# EasyEDA Pro project 便携式气体检测仪_2025-04-28.epro, board PCB1
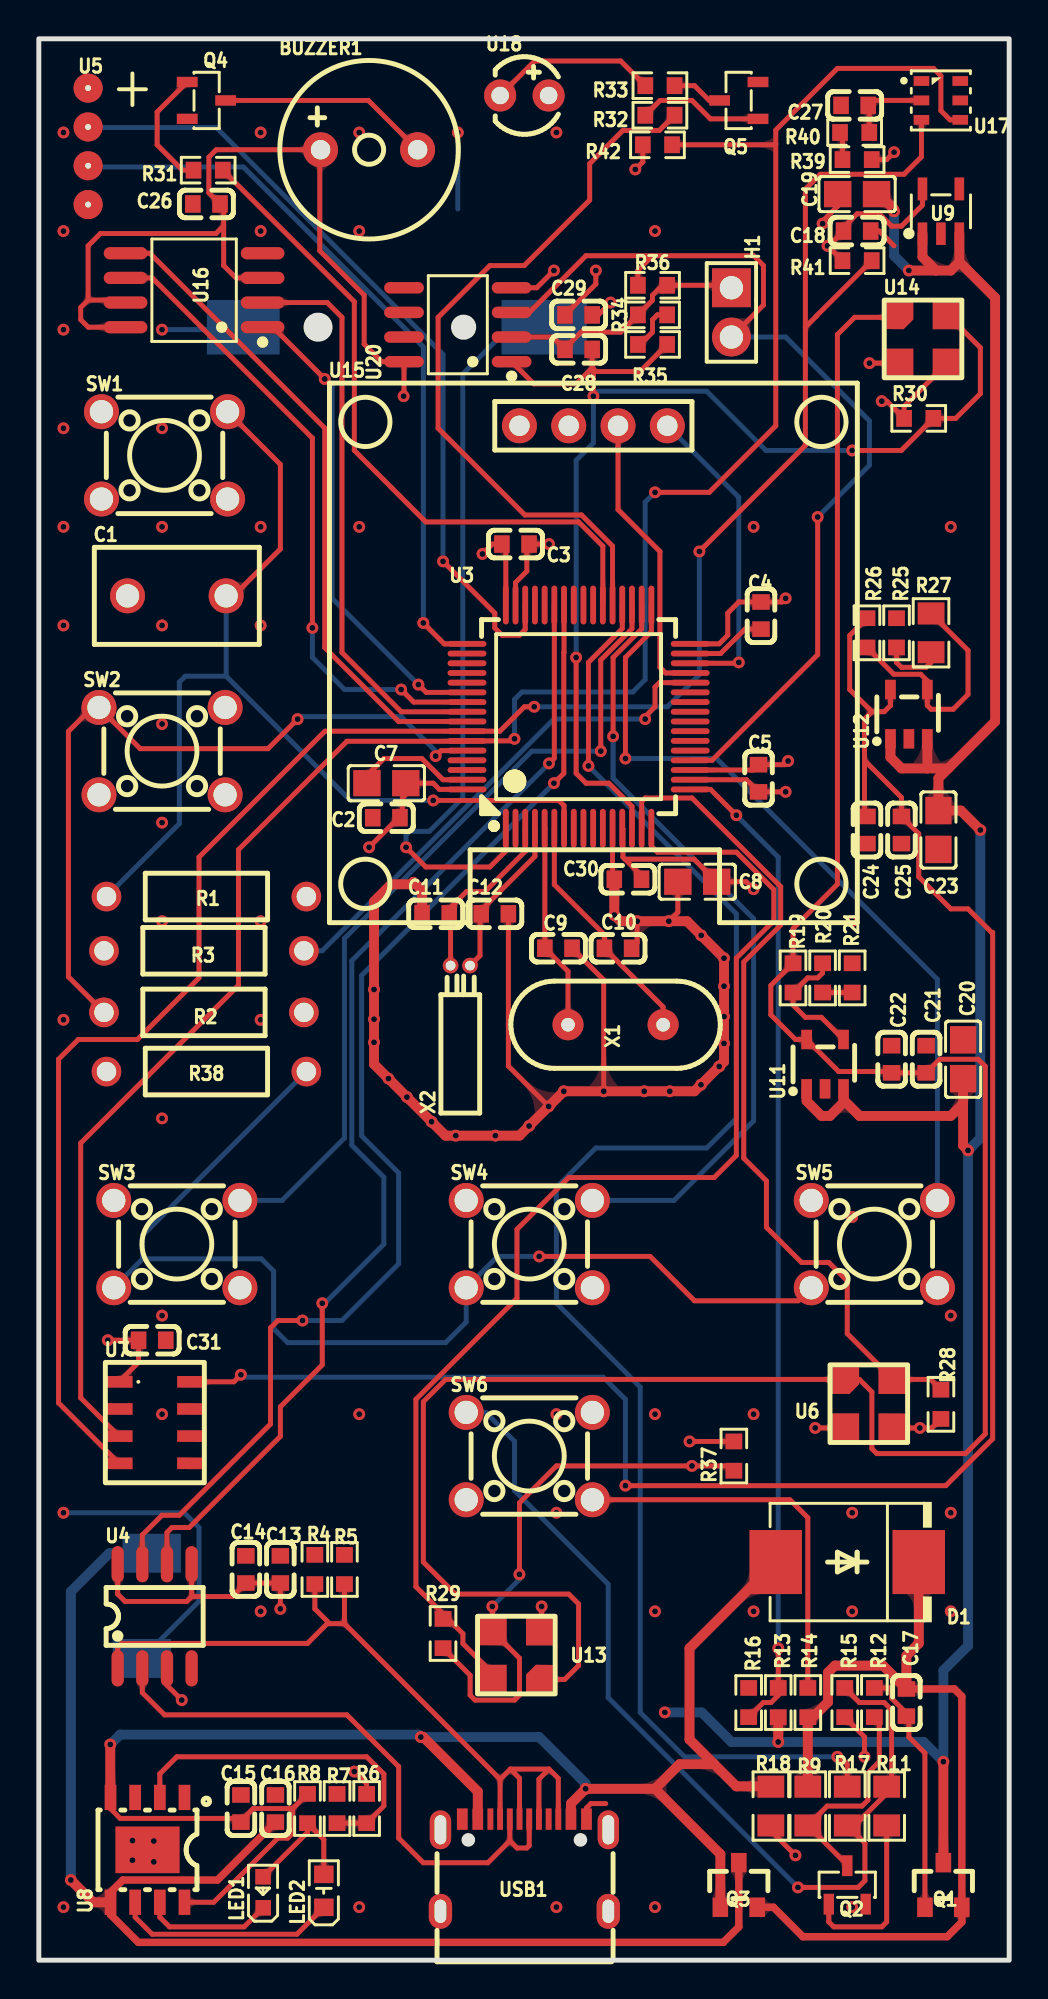
[diagram p3: board, top side]
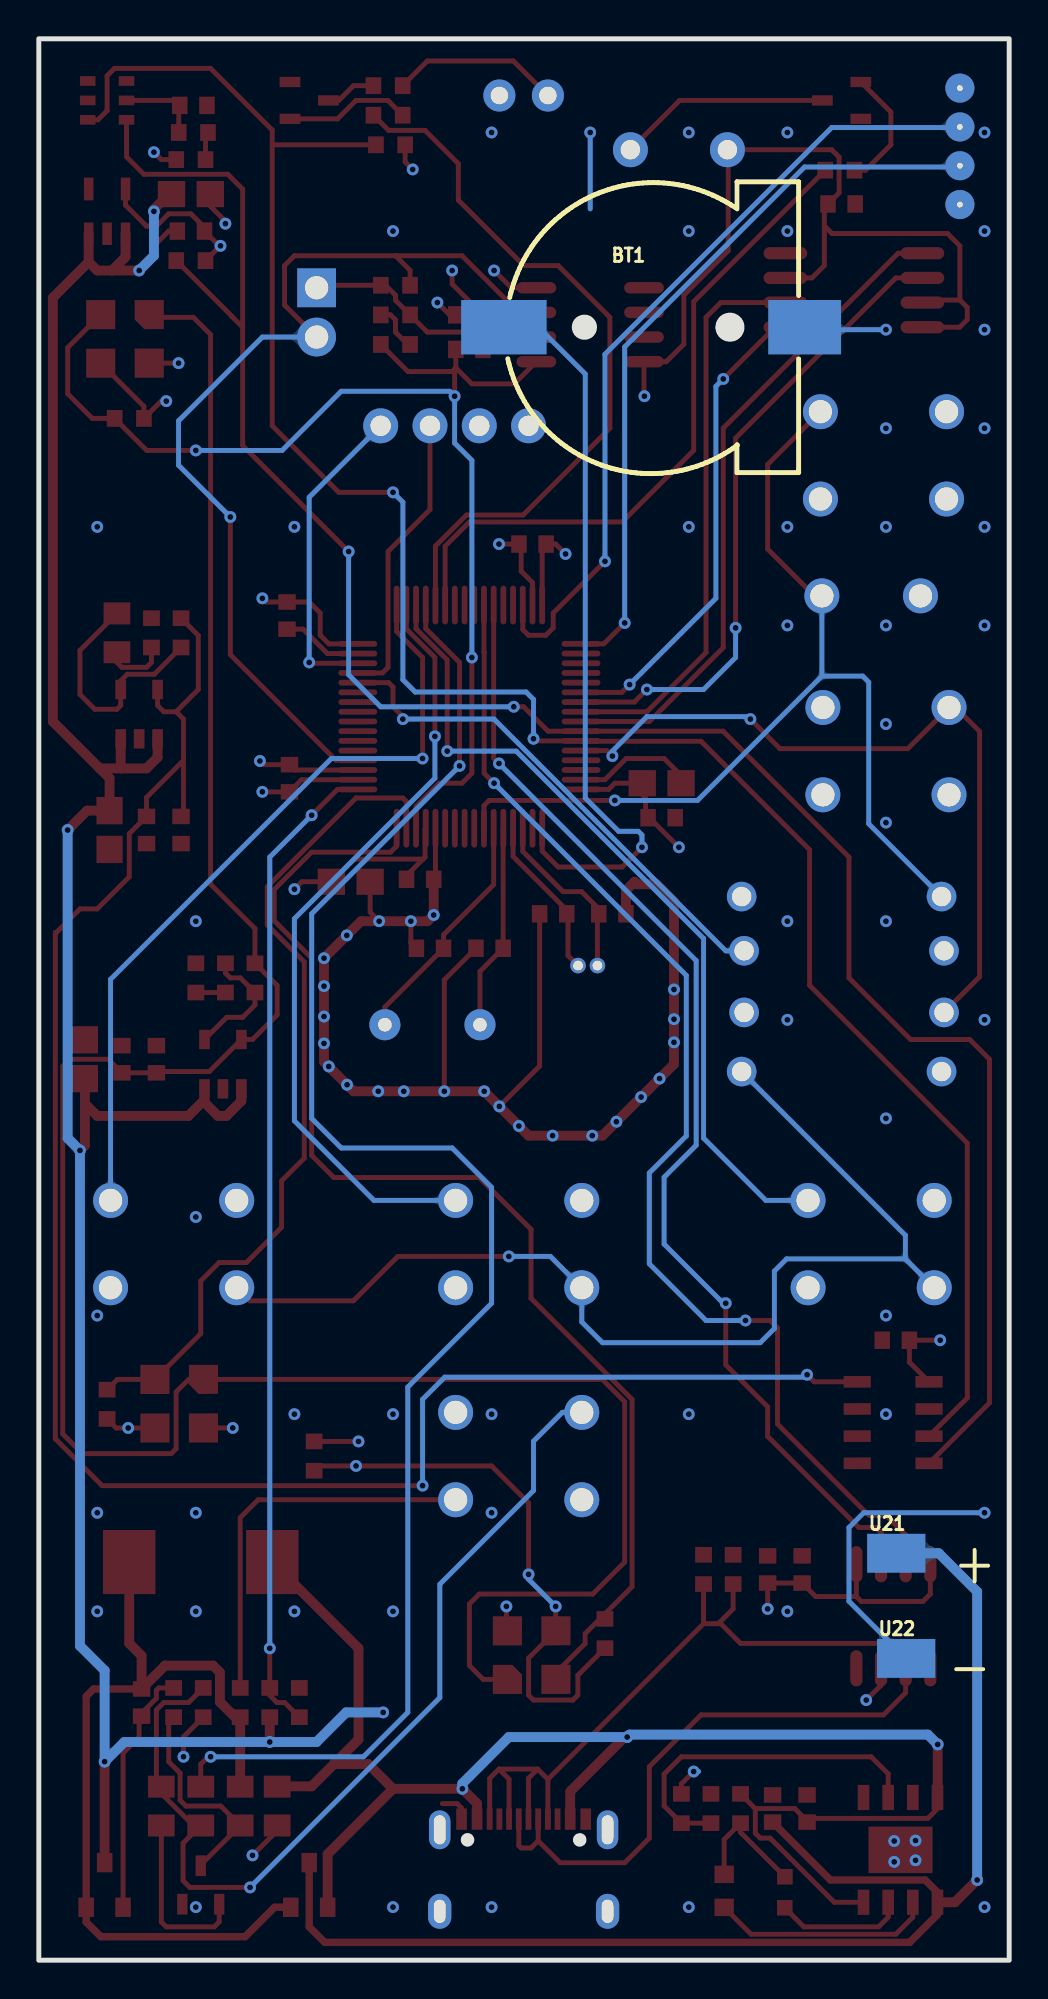
[diagram p4: board, bottom side, seen from below]

Outline 50 x 99 mm; copper layers: Top Layer, Inner1, Inner2, Bottom Layer. Coordinates in mm from the lower left corner of the outline.
Outline path: rectangle 0,99 50,0
Stack: Top Layer 0.035mm 外层铜厚1oz / Dielectric1 0.2104mm 7628 RC49% 8.6mil / Inner1 0.0152mm 内层铜厚 / Dielectric2 1.065mm 1.1mm H/HOZ 含铜 / Inner2 0.0152mm 内层铜厚 / Dielectric3 0.2104mm 7628 RC49% 8.6mil / Bottom Layer 0.035mm 外层铜厚1oz

## Design rules (mm)
template: JLCPCB Capability(Two Layers Board)
spacing copperThickness1oz (default): track to track 0.102, other pairs 0.152 to 0.3
spacing copperThickness2oz: track to track 0.203, other pairs 0.152 to 0.3
track width copperThickness1oz (default): min 0.127, default 0.254, max 2.54
track width copperThickness2oz: min 0.203, default 0.254, max 2.54
differential pair differentialPair (default): width min 0.127, default 0.254, max 2.54; gap min 0.152, default 0.152
via viaSize (default): diameter min 0.5, default 0.61, max 10; hole min 0.3, default 0.305, max 6.3

## Placement (name value [footprint] x y rotation side)
BT1  BS-12-B3AA003  [BAT-SMD_BS-12-B3AA011]  18.29 84.14 180 bottom
BUZZER1  3kHz  [BUZ-TH_BD9.0-P5.00-D0.6-FD]  17.02 93.28 0 top
C1  100nF  [CAP-TH_L8.5-W5.0-P5.00-D1.2]  7.11 70.3 0 top
C2  100nF  [C0603]  17.91 58.87 0 top
C3  100nF  [C0603]  24.56 72.97 180 top
C4  100nF  [C0603]  37.21 69.28 90 top
C5  100nF  [C0603]  37.08 60.9 90 top
C7  4.7uF  [C0805]  17.91 60.65 0 top
C8  1uF  [C0805]  33.93 55.57 0 top
C9  20pF  [C0603]  26.78 52.14 180 top
C10  20pF  [C0603]  29.84 52.14 180 top
C11  20pF  [C0603]  20.45 53.92 0 top
C12  20pF  [C0603]  23.5 53.92 0 top
C13  100nF  [C0603]  12.45 20.13 90 top
C14  100nF  [C0603]  10.67 20.13 270 top
C15  10uF  [C0603]  10.41 7.81 270 top
C16  10uF  [C0603]  12.19 7.81 270 top
C17  100nF  [C0603]  44.7 13.28 90 top
C18  100nF  [C0603]  42.16 89.09 180 top
C19  1uF  [C0805]  42.16 91 0 top
C20  1uF  [C0805]  47.62 46.42 270 top
C21  2.2uF  [C0603]  45.72 46.42 270 top
C22  100nF  [C0603]  43.94 46.42 270 top
C23  1uF  [C0805]  46.35 58.23 90 top
C24  2.2uF  [C0603]  42.67 58.23 90 top
C25  100nF  [C0603]  44.45 58.23 90 top
C26  100nF  [C0603]  8.64 90.49 0 top
C27  10uF  [C0603]  42.04 95.57 0 top
C28  10nF  [C0603]  27.81 83 0 top
C29  100nF  [C0603]  27.81 84.78 0 top
C30  10nF  [C0603]  30.35 55.69 0 top
C31  100nF  [C0603]  5.84 31.94 180 top
D1  SS34  [SMC_L6.9-W5.9-LS7.9-RD]  41.66 20.51 180 top
H1  PZ254V-11-02P  [HDR-TH_2P-P2.54-V-M]  35.69 84.9 270 top
LED1  NCD0603R1  [LED0603-RD_RED]  11.56 3.5 90 top
LED2  NCD0603G1  [LED0603-RD_1]  14.69 3.57 90 top
Q1  AO3401A  [SOT-23_L2.9-W1.3-P1.90-LS2.4-BR]  46.61 3.88 270 top
Q2  S8050  [SOT-23-3_L2.9-W1.3-P1.90-LS2.3-BR]  41.66 3.88 270 top
Q3  AO3401A  [SOT-23_L2.9-W1.3-P1.90-LS2.4-BR]  36.07 3.88 270 top
Q4  S8050  [SOT-23-3_L2.9-W1.3-P1.90-LS2.3-BR]  8.64 95.83 180 top
Q5  S8050  [SOT-23-3_L2.9-W1.3-P1.90-LS2.3-BR]  36.07 95.83 0 top
R1  10kΩ  [RES-TH_BD2.4-L6.3-P10.30-D0.6]  8.64 54.8 0 top
R2  10kΩ  [RES-TH_BD2.4-L6.3-P10.30-D0.6]  8.51 48.83 0 top
R3  10kΩ  [RES-TH_BD2.4-L6.3-P10.30-D0.6]  8.51 52.01 180 top
R4  5.1kΩ  [R0603]  14.22 20.13 270 top
R5  5.1kΩ  [R0603]  15.75 20.13 270 top
R6  2.2kΩ  [R0603]  16.89 7.81 270 top
R7  3kΩ  [R0603]  15.37 7.81 270 top
R8  1kΩ  [R0603]  13.84 7.81 90 top
R9  10kΩ  [R0805]  39.62 7.94 270 top
R11  10kΩ  [R0805]  43.69 7.94 270 top
R12  100kΩ  [R0603]  43.05 13.28 90 top
R13  100kΩ  [R0603]  38.1 13.28 270 top
R14  47kΩ  [R0603]  39.62 13.28 270 top
R15  47kΩ  [R0603]  41.53 13.28 90 top
R16  47kΩ  [R0603]  36.58 13.28 270 top
R17  10kΩ  [R0805]  41.66 7.94 270 top
R18  100kΩ  [R0805]  37.72 7.94 90 top
R19  51kΩ  [R0603]  38.86 50.61 90 top
R20  47kΩ  [R0603]  40.39 50.61 90 top
R21  3kΩ  [R0603]  41.91 50.61 270 top
R25  5.1kΩ  [R0603]  44.2 68.39 270 top
R26  2kΩ  [R0603]  42.67 68.39 90 top
R27  10kΩ  [R0805]  45.97 68.39 90 top
R28  1MΩ  [R0603]  46.48 28.64 90 top
R29  1MΩ  [R0603]  20.83 16.83 90 top
R30  1MΩ  [R0603]  45.34 79.44 0 top
R31  1kΩ  [R0603]  8.73 92.23 0 top
R32  1kΩ  [R0603]  32 95.06 0 top
R33  1kΩ  [R0603]  32 96.59 0 top
R34  249Ω  [R0603]  31.62 84.78 0 top
R35  54.9kΩ  [R0603]  31.62 83.25 0 top
R36  100Ω  [R0603]  31.62 86.3 0 top
R37  0Ω  [R0603]  35.81 25.97 90 top
R38  10kΩ  [RES-TH_BD2.4-L6.3-P10.30-D0.6]  8.64 45.79 0 top
R39  249Ω  [R0603]  42.16 92.78 0 top
R40  120Ω  [R0603]  42.04 94.17 0 top
R41  4.7kΩ  [R0603]  42.16 87.57 0 top
R42  4.7kΩ  [R0603]  31.88 93.54 0 top
SW1  TS665CJ  [SW-TH_4P-L6.0-W6.0-P4.50-LS6.5]  6.48 77.54 0 top
SW2  TS665CJ  [SW-TH_4P-L6.0-W6.0-P4.50-LS6.5]  6.35 62.3 0 top
SW3  TS665CJ  [SW-TH_4P-L6.0-W6.0-P4.50-LS6.5]  7.11 36.9 0 top
SW4  TS665CJ  [SW-TH_4P-L6.0-W6.0-P4.50-LS6.5]  25.27 36.9 0 top
SW5  TS665CJ  [SW-TH_4P-L6.0-W6.0-P4.50-LS6.5]  43.05 36.9 0 top
SW6  TS665CJ  [SW-TH_4P-L6.0-W6.0-P4.50-LS6.5]  25.27 25.97 0 top
U3  STM32F103RCT6  [LQFP-64_L10.0-W10.0-P0.50-LS12.0-BL]  27.81 64.08 0 top
U4  CH340N  [SOP-8_L4.9-W3.9-P1.27-LS6.0-BL]  5.97 17.72 0 top
U5  -  [烧录接口]  2.54 96.46 0 top
U6  -  [MEMS模拟]  40.77 30.67 0 top
U7  -  [MEMS数字]  3.43 30.8 0 top
U8  TC4056A  [ESOP-8_L4.9-W3.9-P1.27-LS6.0-BR-EP3.3]  5.6 5.69 90 top
U9  SPX3819M5-L-3-3/TR  [SOT-23-5_L3.0-W1.7-P0.95-LS2.8-BL]  46.48 90.11 0 top
U11  SPX3819M5-L/TR  [SOT-23-5_L3.0-W1.7-P0.95-LS2.8-TL]  40.51 46.17 90 top
U12  SPX3819M5-L/TR  [SOT-23-5_L3.0-W1.7-P0.95-LS2.8-TL]  44.83 64.2 90 top
U13  -  [MEMS模拟]  26.61 13.72 180 top
U14  -  [MEMS模拟]  43.56 85.54 0 top
U15  HS96L03W2C03  [OLED-TH_L27.8-W27.2-P2.54_C9900033791]  28.57 79.06 0 top
U16  W25Q64JVSSIQ  [SOIC-8_L5.3-W5.3-P1.27-LS8.0-BL]  8 86.05 90 top
U17  AHT20  [SENSOR-SMD_L3.0-W3.0-P1.00-BR]  46.48 95.83 180 top
U18  204-10SDRD/S530-A3/F182-68  [LED-TH_BD4.0-P2.50-RD]  25.02 96.08 0 top
U20  SGM8552XS8G/TR  [SOIC-8_L4.9-W3.9-P1.27-LS6.0-BL]  21.59 84.27 90 top
U21  -  [端子]  5.82 20.97 180 bottom
U22  -  [端子]  5.31 15.55 180 bottom
USB1  TYPE-C 16PIN 2MD(073)  [USB-C-SMD_TYPE-C-6PIN-2MD-073]  25.02 4.89 0 top
X1  8MHz  [OSC-TH_L10.0-W4.5-P5.00]  29.72 48.2 90 top
X2  32.768kHz  [OSC-TH_BD2.0-P0.70-D0.3]  21.72 51.25 90 top

## Footprints (pads in the part's own frame, mm; a bottom-side part is the same pattern mirrored in y, then rotated)
BAT-SMD_BS-12-B3AA011
  rect 3.75x2.8 smd: 1(7.75,0)
  rect 4.4x2.8 smd: 2(-7.75,0)
BUZ-TH_BD9.0-P5.00-D0.6-FD
  round 1.8 hole 1: 1(-2.5,0) 2(2.5,0)
C0603
  rect 0.8x0.9 smd: 1(-0.7,0) 2(0.7,0)
C0805
  rect 1.41x1.35 smd: 1(-1,0) 2(1,0)
CAP-TH_L8.5-W5.0-P5.00-D1.2
  round 1.8 hole 1.2: 1(-2.54,0) 2(2.54,0)
ESOP-8_L4.9-W3.9-P1.27-LS6.0-BR-EP3.3
  rect 1.3x0.6 smd: 1(2.7,-1.905) 2(2.7,-0.635) 3(2.7,0.635) 4(2.7,1.905) 5(-2.7,1.905) 6(-2.7,0.635) 7(-2.7,-0.635) 8(-2.7,-1.905)
  rect 2.4x3.3 smd: 9(0,0)
HDR-TH_2P-P2.54-V-M
  rect 2x2 hole 1.2: 1(-1.27,0)
  round 2 hole 1.2: 2(1.27,0)
LED0603-RD_1
  rect 0.9x1 smd: 1(-0.85,0) 2(0.85,0)
LED0603-RD_RED
  rect 0.8x0.8 smd: 1(-0.799,-0.004) 2(0.799,0.004)
LED-TH_BD4.0-P2.50-RD
  round 1.651 hole 0.9: 1(-1.25,0) 2(1.25,0)
LQFP-64_L10.0-W10.0-P0.50-LS12.0-BL
  oval 0.3x2 smd: 1(-3.75,-5.75) 2(-3.25,-5.75) 3(-2.75,-5.75) 4(-2.25,-5.75) 5(-1.75,-5.75) 6(-1.25,-5.75) 7(-0.75,-5.75) 8(-0.25,-5.75) 9(0.25,-5.75) 10(0.75,-5.75) 11(1.25,-5.75) 12(1.75,-5.75) 13(2.25,-5.75) 14(2.75,-5.75) 15(3.25,-5.75) 16(3.75,-5.75) 33(3.75,5.75) 34(3.25,5.75) 35(2.75,5.75) 36(2.25,5.75) 37(1.75,5.75) 38(1.25,5.75) 39(0.75,5.75) 40(0.25,5.75) 41(-0.25,5.75) 42(-0.75,5.75) 43(-1.25,5.75) 44(-1.75,5.75) 45(-2.25,5.75) 46(-2.75,5.75) 47(-3.25,5.75) 48(-3.75,5.75)
  oval 2x0.3 smd: 17(5.75,-3.75) 18(5.75,-3.25) 19(5.75,-2.75) 20(5.75,-2.25) 21(5.75,-1.75) 22(5.75,-1.25) 23(5.75,-0.75) 24(5.75,-0.25) 25(5.75,0.25) 26(5.75,0.75) 27(5.75,1.25) 28(5.75,1.75) 29(5.75,2.25) 30(5.75,2.75) 31(5.75,3.25) 32(5.75,3.75) 49(-5.75,3.75) 50(-5.75,3.25) 51(-5.75,2.75) 52(-5.75,2.25) 53(-5.75,1.75) 54(-5.75,1.25) 55(-5.75,0.75) 56(-5.75,0.25) 57(-5.75,-0.25) 58(-5.75,-0.75) 59(-5.75,-1.25) 60(-5.75,-1.75) 61(-5.75,-2.25) 62(-5.75,-2.75) 63(-5.75,-3.25) 64(-5.75,-3.75)
MEMS数字
  custom 1.4x0.601 smd: 1(0.7,-1) 2(0.7,-2.4) 3(0.7,-3.8) 4(0.7,-5.2)
  custom 1.4x0.602 smd: 5(4.4,-5.199) 6(4.4,-3.799) 7(4.4,-2.399) 8(4.4,-0.999)
MEMS模拟
  custom 1.5x1.5 smd: 1(0.75,-0.749) 3(3.25,-0.75)
  custom 1.501x1.5 smd: 2(3.249,-3.252)
  custom 1.502x1.502 smd: 4(0.751,-3.249)
OLED-TH_L27.8-W27.2-P2.54_C9900033791
  round 1.8 hole 1.05: 1(-3.81,0) 2(-1.27,0) 3(1.27,0) 4(3.81,0)
OSC-TH_BD2.0-P0.70-D0.3
  round 0.8 hole 0.5: 1(0,0.5) 2(0,-0.5)
OSC-TH_L10.0-W4.5-P5.00
  round 1.6 hole 0.7: 1(0,2.45) 2(0,-2.45)
R0603
  rect 0.806x0.864 smd: 1(-0.753,0) 2(0.753,0)
R0805
  rect 1.133x1.377 smd: 1(-1,0) 2(1,0)
RES-TH_BD2.4-L6.3-P10.30-D0.6
  round 1.524 hole 1: 1(-5.15,0) 2(5.15,0)
SENSOR-SMD_L3.0-W3.0-P1.00-BR
  rect 0.8x0.5 smd: 1(1,-1) 2(1,0) 3(1,1) 4(-1,1) 5(-1,0) 6(-1,-1)
SMC_L6.9-W5.9-LS7.9-RD
  rect 2.7x3.3 smd: 1(-3.687,0) 2(3.687,0)
SOIC-8_L4.9-W3.9-P1.27-LS6.0-BL
  oval 0.588x2.045 smd: 1(-1.905,-2.772) 2(-0.635,-2.772) 3(0.635,-2.772) 4(1.905,-2.772) 5(1.905,2.772) 6(0.635,2.772) 7(-0.635,2.772) 8(-1.905,2.772)
SOIC-8_L5.3-W5.3-P1.27-LS8.0-BL
  oval 0.63x2.25 smd: 1(-1.905,-3.53) 2(-0.635,-3.53) 3(0.635,-3.53) 4(1.905,-3.53) 5(1.905,3.53) 6(0.635,3.53) 7(-0.635,3.53) 8(-1.905,3.53)
SOP-8_L4.9-W3.9-P1.27-LS6.0-BL
  oval 0.63x1.865 smd: 1(-1.905,-2.683) 2(-0.635,-2.683) 3(0.635,-2.683) 4(1.905,-2.683) 5(1.905,2.683) 6(0.635,2.683) 7(-0.635,2.683) 8(-1.905,2.683)
SOT-23-3_L2.9-W1.3-P1.90-LS2.3-BR
  rect 1.07x0.532 smd: 1(0.99,-0.95) 2(0.99,0.95) 3(-0.99,0)
SOT-23-5_L3.0-W1.7-P0.95-LS2.8-BL
  rect 0.49x1.157 smd: 1(-0.95,-1.153) 2(0,-1.153) 3(0.95,-1.153)
  rect 0.49x1.175 smd: 4(0.95,1.153) 5(-0.95,1.153)
SOT-23-5_L3.0-W1.7-P0.95-LS2.8-TL
  rect 1x0.55 smd: 1(-1.272,0.95) 2(-1.272,0) 3(-1.272,-0.95) 4(1.272,-0.95) 5(1.272,0.95)
SOT-23_L2.9-W1.3-P1.90-LS2.4-BR
  rect 1x0.8 smd: 1(1.15,-0.95) 2(1.15,0.95) 3(-1.15,0)
SW-TH_4P-L6.0-W6.0-P4.50-LS6.5
  round 1.8 hole 1.2: 1(-3.25,2.25) 2(3.25,2.25) 3(-3.25,-2.25) 4(3.25,-2.25)
USB-C-SMD_TYPE-C-6PIN-2MD-073
  rect 0.55x1.1 smd: 1(-3.2,2.375) 2(-2.4,2.375) 11(2.4,2.375) 12(3.2,2.375)
  rect 0.3x1.1 smd: 3(-1.75,2.375) 4(-1.25,2.375) 5(-0.75,2.375) 6(-0.25,2.375) 7(0.25,2.375) 8(0.75,2.375) 9(1.25,2.375) 10(1.75,2.375)
  oval 1.1x2 hole 0.6x1.5: 13(-4.325,1.825) 14(4.325,1.825)
  oval 1.2x1.8 hole 0.6x1.2: 13(-4.325,-2.375) 14(4.325,-2.375)
烧录接口
  round 1.5 hole 0.3: 1(0,0) 2(0,-2) 3(0,-4) 4(0,-6)
端子
  rect 3x2 smd: 1(0,0)

## Nets
As in the schematic.

Pads without a net: SW1 1 4; SW2 2 3; SW3 1 4; SW4 1 4; SW5 1 4; SW6 2 3; U4 4; U7 2 5 6; U9 4; U17 1 6; U20 5 6 7; USB1 3 9

## Via types
v1: diameter 0.61, hole 0.305, Top Layer to Bottom Layer, 156 vias

## Routing (per net, layer and track width the routed paths; a pad name or vN(x,y) marks a point on that pad's centre or on a via; arc(x,y) is an arc through that point)
+1.4V: length 98.9
  Top Layer w0.254: 42.54,61.82 42.54,59.06 C24.2 ; 42.54,61.82 44.45,59.91 C25.2 45.34,58.04 45.34,55.82 46.99,54.17 47.88,54.17 49.09,52.95 49.15,52.95 49.15,26.86 46.74,24.45 v1(30.23,24.45) ; 42.54,61.82 42.54,63.95 42.93,64.33 ; 42.93,64.33 43.56,64.33 43.88,64.65 U12.5 ; 42.93,64.33 41.78,65.47 41.78,68.26 R26.2 ; v1(10.41,30.17) 10.05,29.8 7.83,29.8
  Bottom Layer w0.254: v1(30.23,24.45) 30.23,28.9 29.08,30.04 10.54,30.04 v1(10.41,30.17)
+2.5V: length 127.5
  Top Layer w0.254: U13.1 27.1,14.47 27.81,15.18 27.81,18.35 27.31,18.86 21.46,18.86 19.81,20.51 19.81,28.77 20.96,29.93 U6.1 42.28,29.93 42.93,29.28 42.93,26.36 43.18,26.1 47.75,26.1 48.77,27.12 48.77,46.05 48.4,46.42 46.42,46.42 C21.2 C22.2 43.88,45.79 41.22,45.79 U11.5 38.99,47.44 37.72,48.71 37.72,50.22 R19.2 38.86,53.15 41.15,55.44 41.15,83.76 42.04,84.65 44.17,84.65 U14.1
+3.3V: length 115.1
  Top Layer w0.254: 7.87,18.74 7.62,18.48 4.44,18.48 4.06,18.86 U4.8 ; 7.87,18.74 U4.5 ; 7.87,18.74 9.97,18.74 10.67,19.43 12.45,19.43 v1(12.45,18.1) ; 40.65,88.33 v1(40.64,88.33) ; 40.65,88.33 40.7,88.33 C18.2 41.46,89.28 42.16,89.98 43.31,89.98 43.94,89.35 44.45,89.35 45.53,90.43 U9.5 ; 40.65,88.33 R41.1 ; v1(28.7,87.06) 28.7,86.36 C29.1 ; 9.53,89.36 9.13,88.97 3.17,88.97 2.54,88.33 2.54,85.54 ; 9.53,89.36 9.53,90.3 C26.2 8.76,91.06 8.76,92.9 9.14,93.28 BUZZER1.1 14.48,93.25 14.48,88.08 16.76,85.79 16.76,83.27 17.67,82.36 U20.8 18.82,80.61 v1(18.8,80.58) ; 9.53,89.36 9.53,87.32 10.16,86.68 11.53,86.68 ; R42.1 31.12,92.66 v1(30.73,92.27) ; U3.32 35.05,67.83 35.5,68.27 35.5,69.41 36.07,69.98 C4.2 38.29,69.98 v1(38.48,70.17) ; U14.4 v1(42.8,82.29) ; v1(22.86,72.46) 23.37,72.97 C3.2 24.06,72.76 U3.48 ; v1(3.56,31.94) C31.2 5.14,30.81 U7.1 ; v1(25.91,18.23) 25.91,17.02 U13.4 ; 19.03,60.65 C7.2 ; 19.03,60.65 19.03,60.18 18.73,59.88 18.73,59.06 v1(17.02,57.34) ; 19.03,60.65 20.32,60.65 20.64,60.33 U3.64 ; v1(44.07,93.16) 43.69,92.78 R39.2 ; v1(38.61,61.79) 38.42,61.6 C5.2 36.81,61.33 U3.19 ; U16.8 2.55,84.14 2.16,84.53 2.16,85.16 2.54,85.54 ; 2.54,85.54 4.34,85.54 U16.7 ; U6.4 v1(40,27.42) ; U3.13 30.1,58.29 30.1,56.84 30.2,56.73 ; C30.2 31.05,55.88 30.2,56.73 ; 30.2,56.73 33.76,56.73 C8.2 36.45,55.57 v1(36.83,55.19)
  Bottom Layer w0.254: v1(38.61,61.79) 38.61,61.92
+5V_IN: length 87
  Top Layer w0.254: U8.8 9.01,2.99 12.32,6.29 12.83,6.29 13.08,6.54 13.08,7.81 13.09,7.81 ; 13.09,7.81 11.05,7.81 10.41,7.18 C15.2 10.22,7.31 4.19,7.31 3.7,7.8 U8.4 ; 13.09,7.81 R8.2
  Top Layer w0.508: 34.8,10.1 33.53,11.37 33.53,16.07 D1.2 ; 34.8,10.1 35.94,8.96 37.7,8.96 R18.2 ; 34.8,10.1 33.02,10.1 31.75,8.83 ; v1(3.68,11.12) 3.68,8.4 U8.4 ; v1(19.69,11.5) 19.81,11.5 22.62,8.69 USB1.2 ; Q3.1 35.12,5.46 31.75,8.83 ; 31.75,8.83 v1(28.18,8.83) 27.42,8.07 USB1.11
  Bottom Layer w0.508: v1(3.68,11.12) 4.19,11.62 19.56,11.62 v1(19.69,11.5) 25.78,11.5 28.18,9.1 v1(28.18,8.83)
AGND: length 40.6
  Top Layer w0.254: v1(26.54,87.06) 25.65,86.17 U20.4 ; v1(23.37,18.23) 23.37,16.98 U13.2 24.76,15.56 24.76,13.66 24.51,13.4 22.48,13.4 22.22,13.66 22.22,14.68 R29.1 ; C29.2 28.83,84.78 v1(29.46,85.41) ; R28.1 46.02,27.42 v1(45.4,27.42) U6.2 ; v1(43.43,80.33) 43.7,80.33 R30.1 44.59,80.06 U14.2 ; R37.1 35.57,25.47 v1(33.66,25.47) 26.67,25.47 24.76,23.56 v1(24.76,19.88)
  Bottom Layer w0.254: 23.37,18.1 v1(23.37,18.23) 24.76,19.62 v1(24.76,19.88)
GND: length 132
  Top Layer w0.254: U3.47 24.56,70.98 25.15,71.57 25.15,72.85 C3.1 v1(26.29,72.97) ; C9.1 29.11,50.51 v1(29.11,44.77) ; v1(42.54,10.48) 42.54,11.51 R15.1 ; v1(30.83,53.53) 30.83,52.42 C10.1 ; v1(40.39,89.47) 40.39,89.6 41.16,90.38 C19.1 ; U3.12 29.56,55.78 29.65,55.69 ; v1(7.37,13.4) 6.6,14.16 U4.3 ; U3.63 20.83,60.83 19.74,61.92 17.78,61.92 16.91,61.04 C7.1 ; R6.1 16.89,9.08 v1(16.26,9.72) ; 44.07,88.33 43.31,89.09 C18.1 ; v1(26.27,43.99) 24.19,46.07 C12.2 ; USB1.12 28.22,7.84 28.45,8.07 29.21,8.07 ; R37.2 v1(33.53,26.73) ; C8.1 32.93,54 v1(32.47,53.53) ; C4.1 36.38,68.58 35.13,67.33 U3.31 ; U3.18 36.46,60.83 C5.1 v1(38.48,60.2) ; v1(38.99,5.4) 37.72,6.67 R18.1
  Top Layer w0.508: C11.1 19.75,55.12 19.3,55.57 19.18,55.44 18.16,55.44 17.27,54.55 v1(17.27,50.02) v1(17.27,48.49) v1(17.27,47.29) 17.27,46.17 v1(18.01,45.43) v1(18.97,44.47) v1(20.24,43.2) 20.96,42.48 v1(21.48,42.48) v1(23.53,42.48) 24.76,42.48 v1(25.26,42.98) v1(26.27,43.99) v1(27.05,44.77) v1(29.11,44.77) v1(31.19,44.77) v1(32.51,44.77) 33.78,44.77 v1(34.12,45.11) v1(35.06,46.05) 35.31,46.3 v1(35.31,47.24) v1(35.31,48.62) v1(35.31,50.19) v1(35.31,51.63) v1(34.13,52.81) 33.4,53.53 v1(32.47,53.53) v1(30.83,53.53) 29.97,53.53 v1(29.65,53.85) 29.65,55.69
  Bottom Layer w0.254: v1(40.39,89.47) 40.39,89.6 ; v1(1.27,23.05) 7.49,23.05 8.25,22.29 8.25,18.49 U22.1 ; v1(16.26,9.72) 16,9.72 ; BT1.1 10.41,84.01 v1(6.35,84.01) ; 21.59,90.24 21.59,94.17 v1(21.59,94.17)
  vias: v1(1.27,94.17) v1(1.27,89.09) v1(1.27,84.01) v1(1.27,78.93) v1(1.27,73.85) v1(1.27,68.77) v1(1.27,48.45) v1(1.27,2.73) v1(4.83,6.16) v1(4.83,5.15) v1(5.93,6.14) v1(5.93,5.07) v1(6.35,78.93) v1(6.35,73.85) v1(6.35,68.77) v1(6.35,63.69) v1(6.35,58.61) v1(6.35,53.53) v1(6.35,43.37) v1(6.35,33.21) v1(6.35,28.13) v1(11.43,94.17) v1(11.43,89.09) v1(11.43,73.85) v1(11.43,68.77) v1(11.43,53.53) v1(11.43,48.45) v1(11.43,17.97) v1(16.51,94.17) v1(16.51,89.09) v1(16.51,73.85) v1(16.51,28.13) v1(16.51,2.73) v1(26.67,94.17) v1(26.67,28.13) v1(26.67,23.05) v1(26.67,2.73) v1(31.75,89.09) v1(31.75,28.13) v1(31.75,17.97) v1(31.75,2.73) v1(36.83,73.85) v1(36.83,28.13) v1(36.83,17.97) v1(41.91,53.53) v1(41.91,38.29) v1(41.91,23.05) v1(41.91,17.97) v1(41.91,2.73) v1(46.99,73.85) v1(46.99,33.21) v1(46.99,23.05) v1(46.99,17.97)
VCC: length 134.8
  Top Layer w0.254: 41.46,44.33 U11.3
  Top Layer w0.508: 46.23,87.06 45.53,87.76 U9.1 ; 46.23,87.06 v1(44.83,87.06) ; 46.23,87.06 46.99,87.06 47.43,87.5 ; 45.76,61.41 44.45,61.41 43.88,61.98 U12.1 ; 45.76,61.41 45.78,61.43 U12.3 ; 45.76,61.41 46.86,61.41 ; 43.16,91.13 44.07,90.22 v1(44.07,90.11) ; 47.62,44.14 C20.2 ; 47.62,44.14 47.62,41.98 v1(47.88,41.72) ; 47.62,44.14 46.99,43.5 42.29,43.5 41.46,44.33 41.46,44.2 40.77,43.5 40.33,43.5 39.56,44.27 U11.1 ; Q1.3 v1(46.61,10.23) ; 47.43,87.5 49.28,85.66 49.28,63.82 46.86,61.41 ; 47.43,87.5 U9.3 ; v1(38.1,11.24) R13.2 ; v1(48.51,58.23) 47.51,59.23 C23.2 46.35,60.9 46.86,61.41
  Bottom Layer w0.508: v1(44.83,87.06) 44.07,87.82 v1(44.07,90.11) ; v1(48.51,58.23) 48.51,42.36 v1(47.88,41.72) 47.88,16.2 46.61,14.93 v1(46.61,10.23) 45.59,11.24 v1(38.1,11.24) 35.69,11.24 34.16,12.77 v1(32.26,12.77)
VCC_IN: length 43.9
  Top Layer w0.381: C17.2 47.18,13.97 47.56,13.59 Q1.2 47.56,1.97 46.8,1.21 39.37,1.21 37.85,2.73 Q3.2
  Top Layer w0.508: R9.1 39.62,12.26 40.67,13.3 40.67,14.83 41.02,15.18 43.5,15.18 C17.2 44.7,15.69 45.34,16.33 D1.1
BAT+: length 70.1
  Top Layer w0.381: Q3.3 36.07,1.72 35.27,0.92 5.13,0.92 3.7,2.35 U8.5 3.7,3.5 4.33,4.13 9.21,4.13 C16.2
  Top Layer w0.508: U8.5 2.8,2.99 v1(1.65,4.13)
  Bottom Layer w0.508: v1(1.65,4.13) 1.65,18.99 3.63,20.97 U21.1
BAT_ADC: length 51.2
  Top Layer w0.254: v1(38.1,16.07) R13.1 38.1,13.65 37.73,13.28 37.33,13.28 R16.2 ; U3.17 34.61,60.33 v1(35.94,59)
  Bottom Layer w0.254: v1(38.1,16.07) 38.1,56.84 v1(35.94,59)
BOOT0: length 39
  Top Layer w0.254: v1(20.45,62.04) 20.73,62.33 U3.60 ; v1(13.34,63.95) 11.81,62.42 5.22,62.42 SW2.1 2.76,64.55 1.52,63.31 1.52,50.67 3.36,48.83
  Bottom Layer w0.254: v1(20.45,62.04) 20.45,62.3 18.67,64.08 13.46,64.08 v1(13.34,63.95)
BOOT1: length 26.5
  Top Layer w0.254: v1(31.24,63.95) 31.12,63.95 31.75,64.58 31.75,65.6 31.98,65.83 U3.28
  Bottom Layer w0.254: R3.1 14.6,52.01 26.54,63.95 v1(31.24,63.95)
BUZZ: length 35.1
  Top Layer w0.254: R31.2 16.26,85.46 16.26,77.79 19.94,74.11 27.81,74.11 29.06,72.86 U3.38
CH2OADC: length 62.5
  Top Layer w0.254: U13.3 23.36,14.81 21.85,16.31 21.85,16.82 19.43,19.24 19.43,28.9 24.64,34.1 24.64,37.66 27.31,40.33 34.8,40.33 35.94,41.47 35.94,51.63 37.87,53.56 37.87,55.16 35.95,57.09 31.88,57.09 31.56,57.4 U3.16
CLK: length 33.3
  Top Layer w0.254: 4.47,86.68 5.84,86.68 14.1,78.43 v1(14.1,68.65) ; U3.55 19.32,64.83 v1(18.67,65.47)
  Bottom Layer w0.254: v1(18.67,65.47) 15.75,65.47 14.1,67.12 v1(14.1,68.65)
COADC: length 63.6
  Top Layer w0.254: 28.51,82.05 27.69,81.22 25.51,81.22 U20.1 ; 28.51,82.05 28.57,81.98 ; 28.51,82.05 C28.2 ; v1(41.91,77.79) 44.44,77.79 R30.2 47.24,79.44 48.51,80.71 48.51,83.08 U14.3 ; 28.57,81.98 28.71,81.86 30.98,81.86 R35.2 ; 28.57,81.98 v1(28.57,80.58) ; U3.14 30.56,59.45 29.37,60.65 28.19,60.65 27.69,61.15 v1(27.69,67.12)
  Bottom Layer w0.254: v1(41.91,77.79) 37.47,77.79 34.42,80.84 28.83,80.84 v1(28.57,80.58) 28.57,78.17 27.69,77.28 v1(27.69,67.12)
CS: length 24.7
  Top Layer w0.254: v1(19.56,65.73) 19.96,65.33 U3.54 ; v1(14.73,81.47) 12.06,84.14 U16.1
  Bottom Layer w0.254: v1(14.73,81.47) 15.11,81.09 15.11,70.17 v1(19.56,65.73)
DI: length 34.2
  Top Layer w0.254: U16.5 5.72,87.95 14.73,78.94 14.73,67.63 18.54,63.83 U3.57
DO: length 29.4
  Top Layer w0.254: U16.2 14.86,85.41 15.62,84.65 15.62,67.38 18.67,64.33 U3.56
H2SADC: length 43.4
  Top Layer w0.254: U3.15 31.06,59.7 31.24,59.88 33.66,59.88 38.23,55.31 38.23,53.34 36.32,51.43 36.32,41.32 37.49,40.15 37.49,37.76 39.31,35.95 40.71,35.95 41.66,35 41.66,32.28 U6.3 45.95,29.92 R28.2
IIC_SCL: length 107.7
  Top Layer w0.254: 39.5,84.14 40.06,84.7 40.06,84.71 R41.2 ; 39.5,84.14 39.5,78.05 v1(34.04,72.58) ; 39.5,84.14 39.5,91.25 40.26,92.02 44.58,92.02 45.48,92.92 U17.3 ; U7.4 1.02,28.71 1.02,46.42 2.03,47.44 5.08,47.44 8.25,50.61 8.25,56.84 14.74,63.33 U3.58 23.76,63.33 25.02,64.58 v1(25.53,64.58)
  Bottom Layer w0.254: v1(25.53,64.58) 32.38,64.58 34.04,66.23 v1(34.04,72.58)
IIC_SDA: length 111.3
  Top Layer w0.254: R42.2 37.93,93.54 37.97,93.58 ; v1(24.51,62.93) 24.4,62.83 U3.59 22.04,62.81 15.88,62.81 10.29,57.22 10.29,50.23 2.16,42.1 2.16,28.97 U7.3 ; v1(31.75,75.63) 34.54,75.63 37.97,79.06 37.97,93.58 ; 37.97,93.58 37.97,94.3 41.15,97.48 46.1,97.48 46.48,97.09 46.48,95.3 46.95,94.83 U17.4
  Bottom Layer w0.254: v1(31.75,75.63) 31.24,75.12 31.24,65.98 30.61,65.34 24.89,65.34 24.51,64.96 v1(24.51,62.93)
KEY1: length 42.4
  Top Layer w0.254: U3.35 30.56,68.6 28.96,67 v1(28.96,62.3)
  Bottom Layer w0.254: SW3.2 12.54,39.15 15.75,42.36 15.75,52.64 25.4,62.3 v1(28.96,62.3)
KEY2: length 40.2
  Top Layer w0.254: U3.34 31.06,68.59 29.59,67.12 v1(29.59,63.06)
  Bottom Layer w0.254: v1(29.59,63.06) 29.59,60.9 36.83,53.66 36.83,43.25 32.73,39.15 SW4.2
KEY3: length 40.6
  Top Layer w0.254: v1(30.23,61.92) 30.23,67.12 31.56,68.46 U3.33
  Bottom Layer w0.254: v1(30.23,61.92) 34.93,61.92 46.3,50.54 SW5.2
LED: length 37.9
  Top Layer w0.254: U3.37 29.56,72.86 27.96,74.46 25.04,74.46 20.57,78.93 20.57,84.65 23.24,87.32 25.01,87.32 28.38,90.69 28.38,92.57 30.1,94.28 31.98,94.28 R32.2
MCU_RX: length 59.7
  Top Layer w0.254: v1(26.29,61.66) 26.56,61.94 U3.43 ; U4.6 6.6,22.04 6.86,22.29 7.75,22.29 12.45,26.99 12.45,28.51 14.6,30.67 v1(14.6,33.85)
  Bottom Layer w0.254: v1(26.29,61.66) 16.13,51.5 16.13,41.99 17.78,40.34 17.78,36.9 14.73,33.85 v1(14.6,33.85)
MCU_TX: length 62.2
  Top Layer w0.254: v1(13.59,32.96) 12.32,32.96 11.94,32.58 11.94,27.63 7.24,22.93 6.35,22.93 5.33,21.91 5.33,20.67 ; U3.42 27.06,67.39 27.05,67.38 27.05,61.15 v1(26.54,60.65)
  Bottom Layer w0.254: v1(26.54,60.65) 16.64,50.74 16.64,42.47 18.54,40.56 18.54,35.88 15.62,32.96 v1(13.59,32.96)
NRST: length 52.6
  Top Layer w0.254: U3.7 27.06,59.49 26.8,59.76 v1(20.32,59.76) ; C1.2 10.03,70.3 12.45,72.71 12.45,77.07 SW1.2
  Bottom Layer w0.254: 9.65,66.16 7.55,66.16 7.24,65.85 7.24,58.56 R1.1 ; 9.65,66.16 C1.2 ; 9.65,66.16 16.06,59.76 v1(20.32,59.76)
OLED_SCL: length 15
  Top Layer w0.254: U3.29 32.29,66.33 32,66.61 32,72.58 29.84,74.74 U15.3
OLED_SDA: length 16.2
  Top Layer w0.254: U3.30 36.02,66.83 v1(36.07,66.87)
  Bottom Layer w0.254: U15.4 36.07,75.38 v1(36.07,66.87)
OSC32_IN: length 9.3
  Top Layer w0.254: U3.3 25.06,57.13 22.99,55.06 22.04,55.06 21.15,54.17 21.15,53.66 21.22,53.59 X2.1
OSC32_OUT: length 8.5
  Top Layer w0.254: U3.4 25.56,56.87 22.73,54.04 22.73,51.76 X2.2
OSC_IN: length 10.6
  Top Layer w0.254: U3.5 26.07,58.31 C9.2 27.27,50.95 X1.1
OSC_OUT: length 12.4
  Top Layer w0.254: X1.2 32.17,49.11 C10.2 29.15,52.84 26.56,55.42 U3.6
PA4: length 51.5
  Top Layer w0.254: v1(40.13,74.36) 40.13,67.27 34.69,61.83 U3.20 ; 31.62,87.82 28.19,87.82 25.27,84.9 U20.3 ; 31.62,87.82 36.83,87.82 37.34,87.32 37.34,85.28 35.69,83.63 ; 31.62,87.82 30.87,87.07 R36.1
  Bottom Layer w0.254: 35.69,83.63 38.48,83.63 42.8,79.31 42.8,77.03 v1(40.13,74.36)
PWR_CTR: length 82.8
  Top Layer w0.254: U3.36 30.06,68.61 28.32,66.87 v1(28.32,61.53) ; R17.1 41.66,10.1 41.28,10.48 v1(41.15,10.48)
  Bottom Layer w0.254: v1(41.15,10.48) 33.27,10.48 30.99,12.77 30.99,29.53 26.67,33.85 26.67,39.82 28.7,41.85 34.42,41.85 35.94,43.37 35.94,53.92 v1(28.32,61.53)
SWCLK: length 38.1
  Top Layer w0.254: U3.49 20.89,67.83 v1(19.81,68.9)
  Bottom Layer w0.254: v1(19.81,68.9) 19.81,83.12 10.54,92.4 2.6,92.4 U5.3
SWDIO: length 42.7
  Top Layer w0.254: v1(20.83,72.08) 23.5,69.41 23.5,68.65 23.88,68.27 24.76,68.27 25.06,68.56 U3.46
  Bottom Layer w0.254: v1(20.83,72.08) 20.83,82.74 9.14,94.43 3.07,94.43 ; 3.04,94.46 3.07,94.43 ; 3.04,94.46 2.54,94.96 ; 3.04,94.46 U5.2 2.57,94.43 3.07,94.43
UD+: length 42.1
  Top Layer w0.254: USB1.8 25.77,9.33 26.29,9.85 ; 24.3,9.85 26.29,9.85 ; 24.3,9.85 24.77,9.37 USB1.6 ; 24.3,9.85 23.77,9.32 ; 26.29,9.85 26.77,9.37 USB1.10 ; 23.77,9.32 15.75,17.34 ; 23.77,9.32 USB1.4 ; 15.75,17.34 R5.2 ; 15.75,17.34 14.99,17.34 ; U4.1 4.06,16.1 4.29,16.32 13.84,16.32 14.86,17.34 14.99,17.34 ; 14.99,17.34 14.22,18.1 R4.2
UD-: length 29.7
  Top Layer w0.254: USB1.7 25.27,5.91 25.15,5.78 24.64,5.78 24.27,6.15 ; USB1.5 24.27,6.15 ; 24.27,6.15 23.14,5.02 19.81,5.02 18.54,6.29 18.54,9.97 15.88,12.64 6.48,12.64 5.33,13.78 5.33,14.6
$1N1194: length 38.5
  Top Layer w0.254: U3.1 24.06,57.15 23.24,56.33 19.94,56.33 v1(18.92,57.34)
  Bottom Layer w0.254: v1(18.92,57.34) 18.92,57.98 19.11,58.16 20.12,58.16 21.84,59.88 21.84,81.73 24.26,84.14 BT1.2
$1N4336: length 57.3
  Top Layer w0.254: v1(25.78,36.26) 31.5,36.26 33.79,33.98 39.13,33.98 SW5.3
  Bottom Layer w0.254: 5.35,36.14 5.35,37.35 R38.2 ; 5.35,36.14 SW3.3 ; 5.35,36.14 11.47,36.14 12.1,35.5 12.1,32.55 12.83,31.82 20.96,31.82 22.02,32.89 SW4.3 23.64,36.26 v1(25.78,36.26)
$2N725: length 17.9
  Top Layer w0.254: R7.2 R6.2 17.78,7.95 17.78,9.59 16.89,10.48 7.11,10.48 6.24,9.6 U8.2
$2N786: length 11.4
  Top Layer w0.254: U8.6 4.97,2.21 5.84,1.34 13.3,1.34 LED2.1
$2N790: length 6.7
  Top Layer w0.254: LED1.1 10.58,1.72 6.73,1.72 6.24,2.21 U8.7
$2N887: length 6.7
  Top Layer w0.254: LED2.2 14.69,6.22 R8.1 13.84,6.59 LED1.2
$2N1732: length 11.1
  Top Layer w0.254: 41.66,4.91 R9.2 40.62,7.94 42.42,7.94 42.72,8.24 42.72,9.64 43.31,10.23 43.31,12.27 R12.1
$2N1746: length 9.1
  Top Layer w0.254: Q2.1 40.71,1.97 40.96,1.72 43.43,1.72 43.69,1.97 R11.2
$2N1870: length 49
  Top Layer w0.254: R15.2 42.28,13.28 43.56,13.28 43.94,12.89 43.94,9.19 R11.1 43.69,8.59 42.04,6.94 R17.2 42.57,6.03 42.57,4.1 42.22,3.75 v1(39.12,3.75)
  Bottom Layer w0.254: SW6.1 23.02,28.22 24.51,26.74 24.51,24.2 29.34,19.37 29.34,13.53 v1(39.12,3.75)
$2N1876: length 20.3
  Top Layer w0.254: SW6.4 38.7,23.72 39.62,22.8 R14.1
$2N1887: length 12.8
  Top Layer w0.254: R12.2 43.82,14.03 43.94,13.91 43.94,13.49 44.7,12.73 C17.1 44.83,12.45 44.83,11.5 45.66,10.67 Q1.1
$2N3232: length 1.5
  Top Layer w0.254: R21.2 R20.1
$2N3693: length 3.3
  Top Layer w0.254: R25.2 44.2,66.87 44.45,66.61 45.72,66.61 45.97,66.87 R27.1
$2N3718: length 6.4
  Top Layer w0.254: U11.4 40.32,48.58 39.5,48.58 38.86,49.22 R19.1 39.62,50.61 40.13,50.61 40.39,50.87 R20.2
$2N3922: length 12.5
  Top Layer w0.254: R27.2 47.88,67.49 47.88,65.22 47.12,64.46 45.97,64.46 45.78,64.65 U12.4 45.78,65.92 45.44,66.26 44.05,66.26 R26.1
$3N1610: length 10.9
  Top Layer w0.254: Q4.3 16.98,95.83 BUZZER1.2
$3N1690: length 6.3
  Top Layer w0.254: R31.1 7.4,92.23 6.1,93.54 6.1,95.22 Q4.1
$3N1810: length 2.6
  Top Layer w0.254: Q5.3 34.54,95.83 33.78,96.59 R33.2
$3N1822: length 6.5
  Top Layer w0.254: Q5.1 34.6,94.88 33.66,95.83 32.01,95.83 R32.1
$3N2473: length 13.2
  Top Layer w0.254: H1.1 35.56,86.3 R36.2 32.13,86.3 31.62,85.79 31.62,85.53 R34.1 29.98,83.89 27.94,83.89 27.11,83.06 C28.1 26.48,83.63 U20.2
$3N2719: length 2.5
  Top Layer w0.254: R35.1 30.99,83.25 31.62,83.89 31.62,84.52 31.88,84.78 R34.2
$3N2960: length 8.7
  Top Layer w0.254: U18.1 25.55,97.86 29.98,97.86 R33.1
$3N3988: length 4.2
  Top Layer w0.254: U17.2 43.1,95.83 42.79,95.52 ; 42.79,95.52 R40.2 ; 42.79,95.52 C27.2
$3N4009: length 1.4
  Top Layer w0.254: R40.1 41.41,94.05 R39.1

## Copper pours and planes (outline as drawn; the poured copper is in the pictures)
+3.3V on Inner2: -1.65,105.48 68.58,105.48 68.58,-35.24 -1.65,-35.24
AGND on Bottom Layer: -7.11,136.08 61.59,136.08 61.59,-1.84 -7.11,-1.84
GND on Top Layer: -3.81,102.56 89.79,102.56 89.79,-2.35 -3.81,-2.35
GND on Inner1: -38.73,104.33 63.25,104.33 63.25,-3.49 -38.73,-3.49

Small or netless copper shapes (teardrops, artwork), in the pictures only: 378 on Top Layer, 67 on Bottom Layer

## Text on the board
Bottom Silkscreen Layer: + | -
Top Silkscreen Layer: +
